# Altium schematic sheet Sensors_TestBoard.SchDoc: Sensors_TestBoard
size A3; CheckedBy: YummyCarrot; Author: YummyCarrot; CompanyName: YummyCarrot; DrawnBy: YummyCarrot; Engineer: YummyCarrot; Organization: CRThu; DocumentNumber: 201709STBV100; Revision: v1.0.0; SheetNumber: 201709STBV100P01; SheetTotal: 1; Time: 2017/09/07; DocumentName: Sensors_TestBoard; ProjectName: Sensors_TestBoard
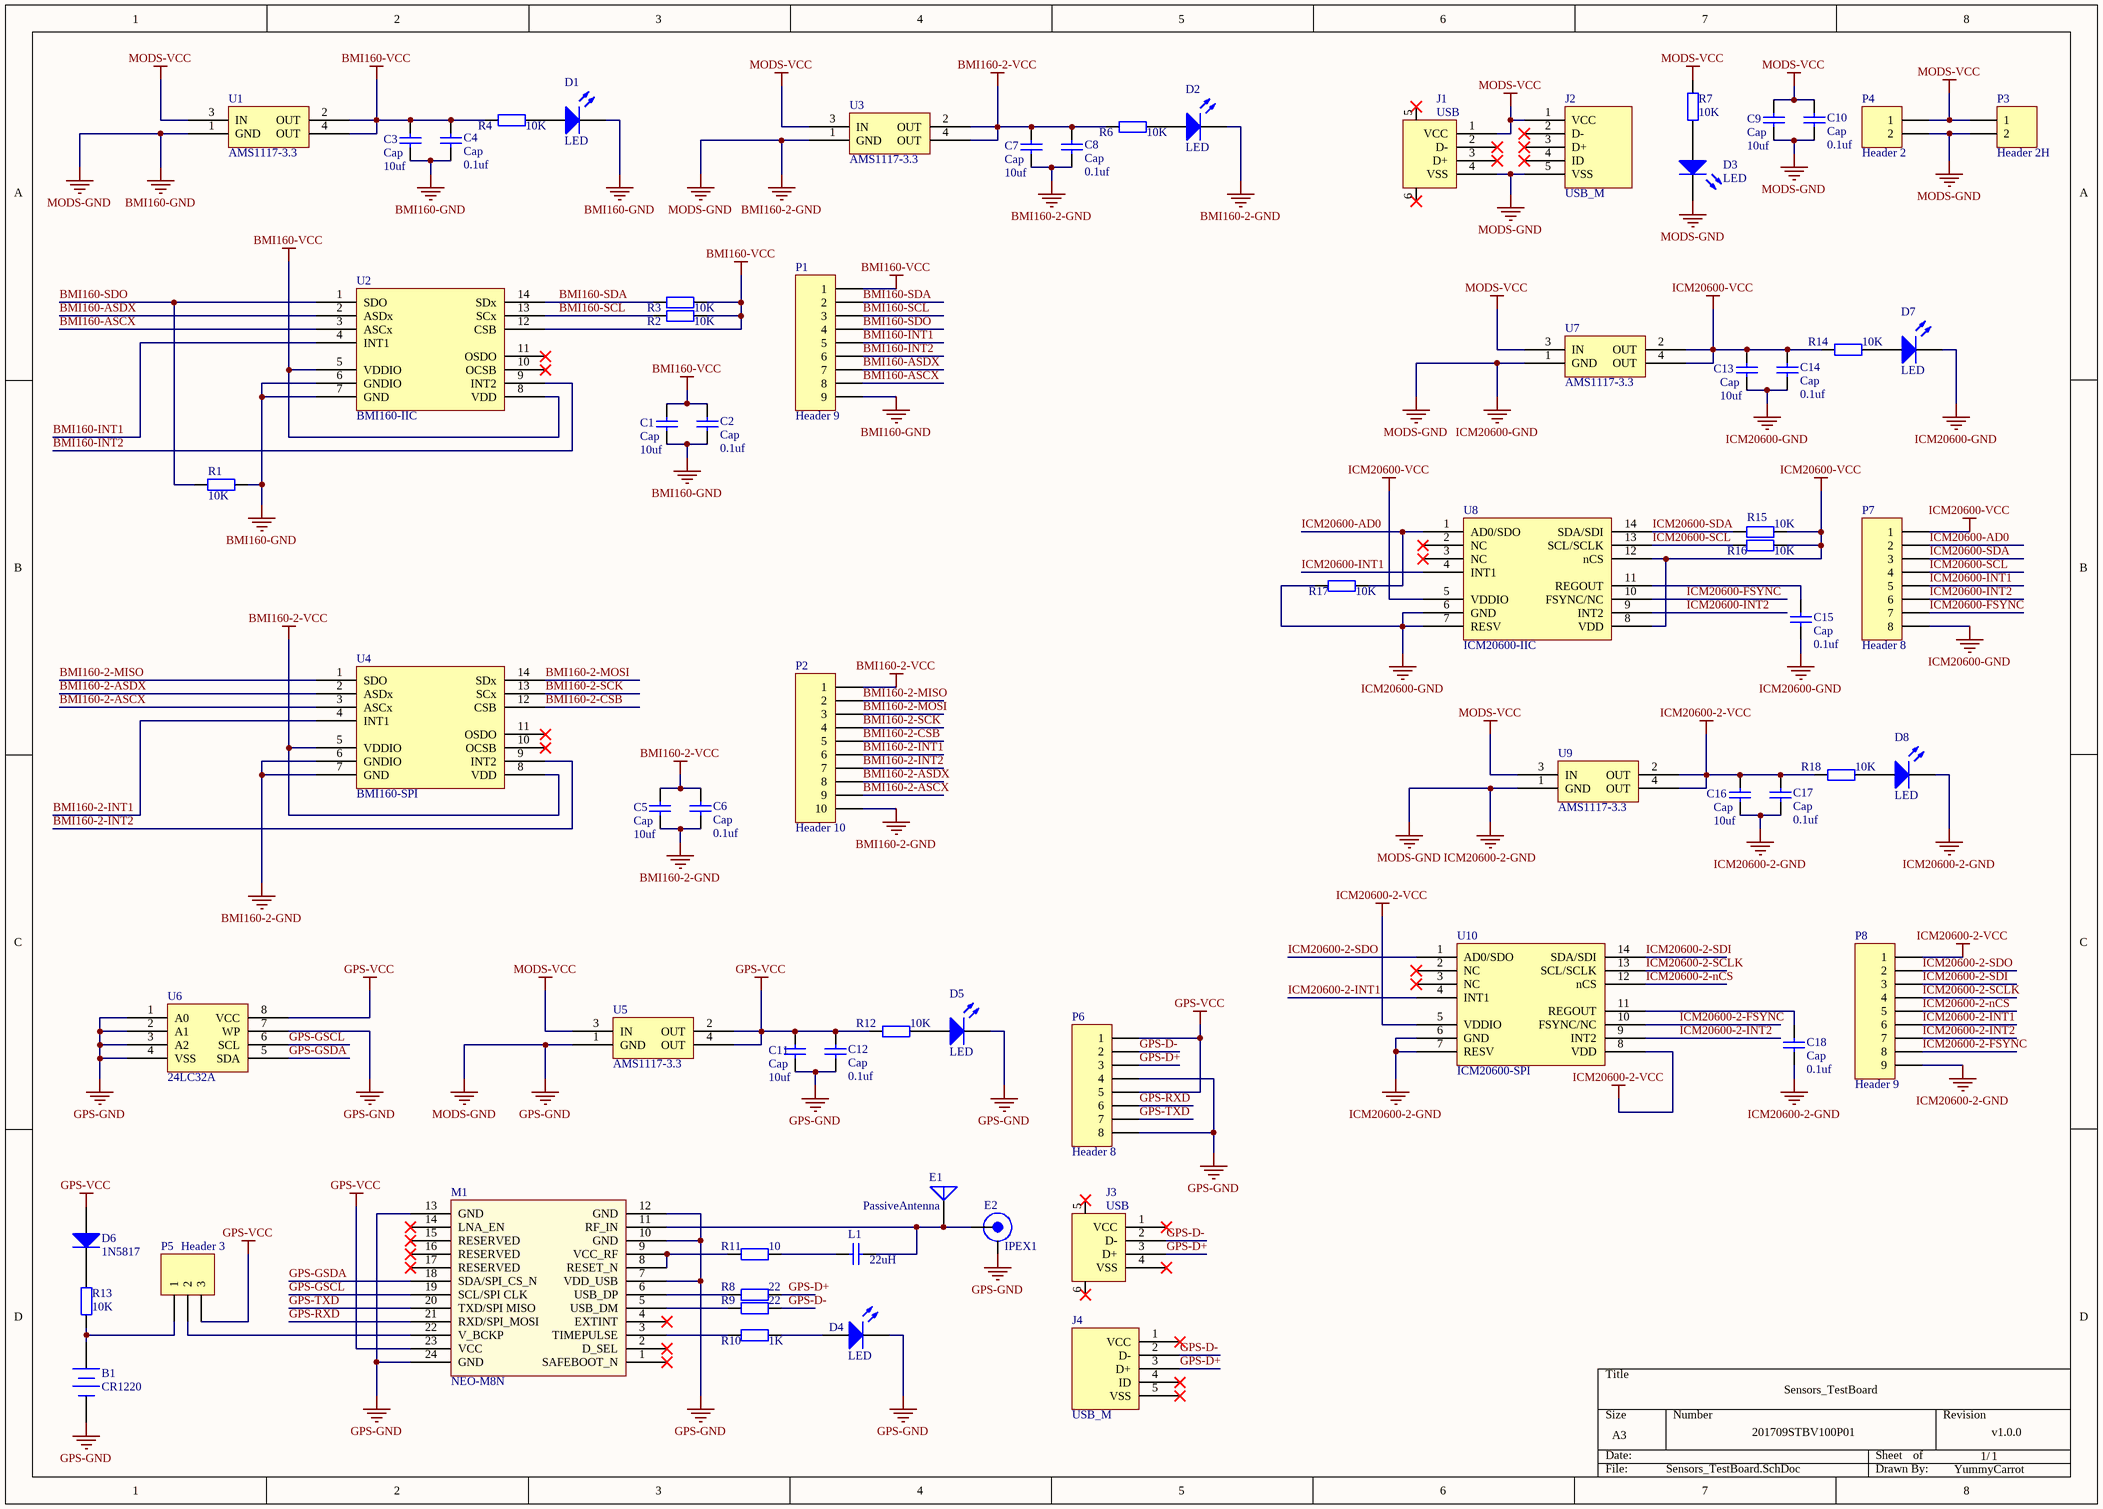
[diagram p0: Sensors_TestBoard.SchDoc]

## Parts
B1  CR1220  [CR1220]
C1  Cap  value 10uf  [C1206]
C2  Cap  value 0.1uf  [C1206]
C3  Cap  value 10uf  [C1206]
C4  Cap  value 0.1uf  [C1206]
C5  Cap  value 10uf  [C1206]
C6  Cap  value 0.1uf  [C1206]
C7  Cap  value 10uf  [C1206]
C8  Cap  value 0.1uf  [C1206]
C9  Cap  value 10uf  [C1206]
C10  Cap  value 0.1uf  [C1206]
C11  Cap  value 10uf  [C1206]
C12  Cap  value 0.1uf  [C1206]
C13  Cap  value 10uf  [C1206]
C14  Cap  value 0.1uf  [C1206]
C15  Cap  value 0.1uf  [C1206]
C16  Cap  value 10uf  [C1206]
C17  Cap  value 0.1uf  [C1206]
C18  Cap  value 0.1uf  [C1206]
D1  LED  [3.2X1.6X1.1]
D2  LED  [3.2X1.6X1.1]
D3  LED  [3.2X1.6X1.1]
D4  LED  [3.2X1.6X1.1]
D5  LED  [3.2X1.6X1.1]
D6  1N5817  [Diode-SMA/DO214AC]
D7  LED  [3.2X1.6X1.1]
D8  LED  [3.2X1.6X1.1]
E1  PassiveAntenna  [PassiveAntenna25x25]
E2  IPEX1  [IPEX1]
J1  USB  [USB_A1]
J2  USB_M  [USB_MICRO]
J3  USB  [USB_A1]
J4  USB_M  [USB_MICRO]
L1  value 22uH  [C1206]  (hidden comment: Cap)
M1  NEO-M8N  [NEO-M8N]
P1  Header 9  [HDR1X9]
P2  Header 10  [HDR1X10]
P3  Header 2H  [HDR1X2H]
P4  Header 2  [HDR1X2]
P5  Header 3  [HDR1X3]
P6  Header 8  [HDR1X8]
P7  Header 8  [HDR1X8]
P8  Header 9  [HDR1X9]
R1  value 10K  [R1206]  (hidden comment: Res)
R2  value 10K  [R1206]  (hidden comment: Res)
R3  value 10K  [R1206]  (hidden comment: Res)
R4  value 10K  [R1206]  (hidden comment: Res)
R6  value 10K  [R1206]  (hidden comment: Res)
R7  value 10K  [R1206]  (hidden comment: Res)
R8  value 22  [R1206]  (hidden comment: Res)
R9  value 22  [R1206]  (hidden comment: Res)
R10  value 1K  [R1206]  (hidden comment: Res)
R11  value 10  [R1206]  (hidden comment: Res)
R12  value 10K  [R1206]  (hidden comment: Res)
R13  value 10K  [R1206]  (hidden comment: Res)
R14  value 10K  [R1206]  (hidden comment: Res)
R15  value 10K  [R1206]  (hidden comment: Res)
R16  value 10K  [R1206]  (hidden comment: Res)
R17  value 10K  [R1206]  (hidden comment: Res)
R18  value 10K  [R1206]  (hidden comment: Res)
U1  AMS1117-3.3  [AMS1117]
U2  BMI160-IIC  [BMI160-LGA14]
U3  AMS1117-3.3  [AMS1117]
U4  BMI160-SPI  [BMI160-LGA14]
U5  AMS1117-3.3  [AMS1117]
U6  24LC32A  [24LC32A-SOIC8-3.90mm]
U7  AMS1117-3.3  [AMS1117]
U8  ICM20600-IIC  [ICM20600-LGA14]
U9  AMS1117-3.3  [AMS1117]
U10  ICM20600-SPI  [ICM20600-LGA14]

## Nets
BMI160-2-GND: B1.2(-) C1.2 C2.2 C3.2 C4.2 C5.2 C6.2 C7.2 C8.2 C9.2 C10.2 C11.2 C12.2 C13.2 C14.2 C15.2 C16.2 C17.2 C18.2 D1.2(K) D2.2(K) D3.2(K) D4.2(K) D5.2(K) D7.2(K) D8.2(K) E2.2(GND) J1.4(VSS) J2.5(VSS) M1.7(VDD_USB) M1.10(GND) M1.12(GND) M1.13(GND) M1.24(GND) P1.9 P2.10 P3.2 P4.2 P6.4 P6.8 P7.8 P8.9 R1.2 R17.1 U1.1(GND) U2.6(GNDIO) U2.7(GND) U3.1(GND) U4.6(GNDIO) U4.7(GND) U5.1(GND) U6.1(A0) U6.2(A1) U6.3(A2) U6.4(VSS) U6.7(WP) U7.1(GND) U8.6(GND) U8.7(RESV) U9.1(GND) U10.6(GND) U10.7(RESV)  [also labelled BMI160-GND, GPS-GND, ICM20600-2-GND, ICM20600-GND, MODS-GND]
BMI160-2-VCC: C5.1 C6.1 C7.1 C8.1 P2.1 R6.1 U3.2(OUT) U3.4(OUT) U4.5(VDDIO) U4.8(VDD)
BMI160-VCC: C1.1 C2.1 C3.1 C4.1 P1.1 R2.2 R3.2 R4.1 U1.2(OUT) U1.4(OUT) U2.5(VDDIO) U2.8(VDD) U2.12(CSB)
GPS-VCC: C11.1 C12.1 D6.1(in) M1.23(VCC) P5.3 P6.1 P6.5 R12.1 U5.2(OUT) U5.4(OUT) U6.8(VCC)
ICM20600-2-VCC: C16.1 C17.1 P8.1 R18.1 U9.2(OUT) U9.4(OUT) U10.5(VDDIO) U10.8(VDD)
ICM20600-VCC: C13.1 C14.1 P7.1 R14.1 R15.2 R16.2 U7.2(OUT) U7.4(OUT) U8.5(VDDIO) U8.8(VDD) U8.12(nCS)
MODS-VCC: C9.1 C10.1 J1.1(VCC) J2.1(VCC) P3.1 P4.1 R7.1 U1.3(IN) U3.3(IN) U5.3(IN) U7.3(IN) U9.3(IN)
BMI160-2-ASCX: P2.9 U4.3(ASCx)
BMI160-2-ASDX: P2.8 U4.2(ASDx)
BMI160-2-CSB: P2.5 U4.12(CSB)
BMI160-2-INT1: P2.6 U4.4(INT1)
BMI160-2-INT2: P2.7 U4.9(INT2)
BMI160-2-MISO: P2.2 U4.1(SDO)
BMI160-2-MOSI: P2.3 U4.14(SDx)
BMI160-2-SCK: P2.4 U4.13(SCx)
BMI160-ASCX: P1.8 U2.3(ASCx)
BMI160-ASDX: P1.7 U2.2(ASDx)
BMI160-INT1: P1.5 U2.4(INT1)
BMI160-INT2: P1.6 U2.9(INT2)
BMI160-SCL: P1.3 R2.1 U2.13(SCx)
BMI160-SDA: P1.2 R3.1 U2.14(SDx)
BMI160-SDO: P1.4 R1.1 U2.1(SDO)
GPS-D+: J3.3(D+) J4.3(D+) P6.3 R8.2
GPS-D-: J3.2(D-) J4.2(D-) P6.2 R9.2
GPS-GSCL: M1.19(SCL/SPI_CLK) U6.6(SCL)
GPS-GSDA: M1.18(SDA/SPI_CS_N) U6.5(SDA)
GPS-RXD: M1.21(RXD/SPI_MOSI) P6.6
GPS-TXD: M1.20(TXD/SPI_MISO) P6.7
ICM20600-2-FSYNC: P8.8 U10.10(FSYNC/NC)
ICM20600-2-INT1: P8.6 U10.4(INT1)
ICM20600-2-INT2: P8.7 U10.9(INT2)
ICM20600-2-nCS: P8.5 U10.12(nCS)
ICM20600-2-SCLK: P8.4 U10.13(SCL/SCLK)
ICM20600-2-SDI: P8.3 U10.14(SDA/SDI)
ICM20600-2-SDO: P8.2 U10.1(AD0/SDO)
ICM20600-AD0: P7.2 R17.2 U8.1(AD0/SDO)
ICM20600-FSYNC: P7.7 U8.10(FSYNC/NC)
ICM20600-INT1: P7.5 U8.4(INT1)
ICM20600-INT2: P7.6 U8.9(INT2)
ICM20600-SCL: P7.4 R16.1 U8.13(SCL/SCLK)
ICM20600-SDA: P7.3 R15.1 U8.14(SDA/SDI)
NetB1_1: B1.1(+) P5.1 R13.2
NetC15_1: C15.1 U8.11(REGOUT)
NetC18_1: C18.1 U10.11(REGOUT)
NetD1_1: D1.1(A) R4.2
NetD2_1: D2.1(A) R6.2
NetD3_1: D3.1(A) R7.2
NetD4_1: D4.1(A) R10.2
NetD5_1: D5.1(A) R12.2
NetD6_2: D6.2(out) R13.1
NetD7_1: D7.1(A) R14.2
NetD8_1: D8.1(A) R18.2
NetE1_1: E1.1 E2.1(ANT) L1.2 M1.11(RF_IN)
NetL1_1: L1.1 R11.2
NetM1_3: M1.3(TIMEPULSE) R10.1
NetM1_5: M1.5(USB_DM) R9.1
NetM1_6: M1.6(USB_DP) R8.1
NetM1_8: M1.8(RESET_N) M1.9(VCC_RF) R11.1
NetM1_22: M1.22(V_BCKP) P5.2

Not connected (* = marked no-connect by the designer): J1 2(D-)* 3(D+)* 5* 6*; J2 2(D-)* 3(D+)* 4(ID)*; J3 1(VCC)* 4(VSS)* 5* 6*; J4 1(VCC)* 4(ID)* 5(VSS)*; M1 1(SAFEBOOT_N)* 2(D_SEL)* 4(EXTINT)* 14(LNA_EN)* 15(RESERVED)* 16(RESERVED)* 17(RESERVED)*; U2 10(OCSB)* 11(OSDO)*; U4 10(OCSB)* 11(OSDO)*; U8 2(NC)* 3(NC)*; U10 2(NC)* 3(NC)*

## Notes on the sheet
- 1/

## Library data of the parts
D1-D5 D7 D8 = LED2: Typical RED, GREEN, YELLOW, AMBER GaAs LED; Published: 8-Jun-2000; LatestRevisionDate: 17-Jul-2002; LatestRevisionNote: Re-released for DXP Platform.; PackageVersion: Feb-2002; PackageReference: 3.2X1.6X1.1; Publisher: Altium Limited; PackageDescription: SM LED; 2 Flat Leads
D6 = Diode
E1 = PassiveAntenna: 无源天线25x25
J1 J3 = USB: USB接口
J2 J4 = USB_M: MicroUSB接口
P1 P8 = Header 9: Header, 9-Pin; LatestRevisionDate: 17-Jul-2002; LatestRevisionNote: Re-released for DXP Platform.; Publisher: Altium Limited
P2 = Header 10: Header, 10-Pin; LatestRevisionDate: 17-Jul-2002; LatestRevisionNote: Re-released for DXP Platform.; Publisher: Altium Limited
P3 = Header 2H: Header, 2-Pin, Right Angle; LatestRevisionDate: 17-Jul-2002; LatestRevisionNote: Re-released for DXP Platform.; Publisher: Altium Limited
P4 = Header 2: Header, 2-Pin; LatestRevisionDate: 17-Jul-2002; LatestRevisionNote: Re-released for DXP Platform.; Publisher: Altium Limited
P5 = Header 3: Header, 3-Pin; LatestRevisionDate: 17-Jul-2002; LatestRevisionNote: Re-released for DXP Platform.; Publisher: Altium Limited
P6 P7 = Header 8: Header, 8-Pin; LatestRevisionDate: 17-Jul-2002; LatestRevisionNote: Re-released for DXP Platform.; Publisher: Altium Limited
U1 U3 U5 U7 U9 = AMS1117
U2 U4 = BMI160
U8 U10 = ICM20600